# Altium schematic sheet Sheet1.SchDoc
size A4
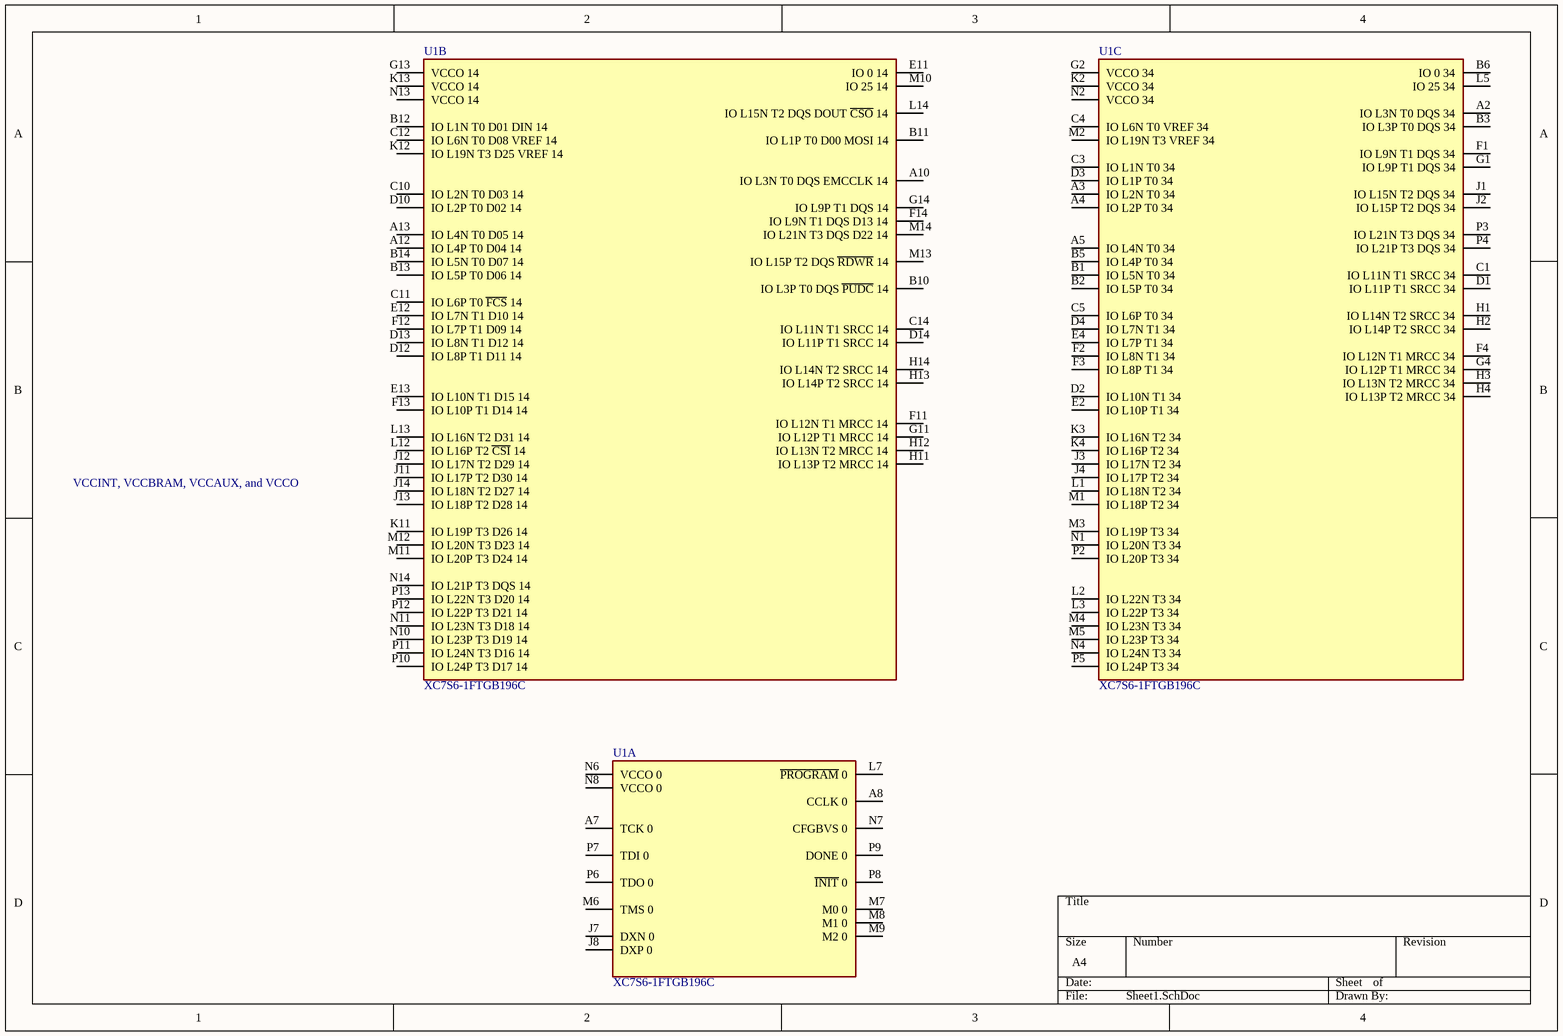
[diagram p0: Sheet1.SchDoc]

## Parts
U1  XC7S6-1FTGB196C  [FP-XC7S6-1FTGB196C-MFG]  (parts A,B,C of 4)

## Nets

Not connected (* = marked no-connect by the designer): U1 A2(IO_L3N_T0_DQS_34) A3(IO_L2N_T0_34) A4(IO_L2P_T0_34) A5(IO_L4N_T0_34) A7(TCK_0) A8(CCLK_0) A10(IO_L3N_T0_DQS_EMCCLK_14) A12(IO_L4P_T0_D04_14) A13(IO_L4N_T0_D05_14) B1(IO_L5N_T0_34) B2(IO_L5P_T0_34) B3(IO_L3P_T0_DQS_34) B5(IO_L4P_T0_34) B6(IO_0_34) B10(IO_L3P_T0_DQS_~{PUDC}_14) B11(IO_L1P_T0_D00_MOSI_14) B12(IO_L1N_T0_D01_DIN_14) B13(IO_L5P_T0_D06_14) B14(IO_L5N_T0_D07_14) C1(IO_L11N_T1_SRCC_34) C3(IO_L1N_T0_34) C4(IO_L6N_T0_VREF_34) C5(IO_L6P_T0_34) C10(IO_L2N_T0_D03_14) C11(IO_L6P_T0_~{FCS}_14) C12(IO_L6N_T0_D08_VREF_14) C14(IO_L11N_T1_SRCC_14) D1(IO_L11P_T1_SRCC_34) D2(IO_L10N_T1_34) D3(IO_L1P_T0_34) D4(IO_L7N_T1_34) D10(IO_L2P_T0_D02_14) D12(IO_L8P_T1_D11_14) D13(IO_L8N_T1_D12_14) D14(IO_L11P_T1_SRCC_14) E2(IO_L10P_T1_34) E4(IO_L7P_T1_34) E11(IO_0_14) E12(IO_L7N_T1_D10_14) E13(IO_L10N_T1_D15_14) F1(IO_L9N_T1_DQS_34) F2(IO_L8N_T1_34) F3(IO_L8P_T1_34) F4(IO_L12N_T1_MRCC_34) F11(IO_L12N_T1_MRCC_14) F12(IO_L7P_T1_D09_14) F13(IO_L10P_T1_D14_14) F14(IO_L9N_T1_DQS_D13_14) G1(IO_L9P_T1_DQS_34) G2(VCCO_34) G4(IO_L12P_T1_MRCC_34) G11(IO_L12P_T1_MRCC_14) G13(VCCO_14) G14(IO_L9P_T1_DQS_14) H1(IO_L14N_T2_SRCC_34) H2(IO_L14P_T2_SRCC_34) H3(IO_L13N_T2_MRCC_34) H4(IO_L13P_T2_MRCC_34) H11(IO_L13P_T2_MRCC_14) H12(IO_L13N_T2_MRCC_14) H13(IO_L14P_T2_SRCC_14) H14(IO_L14N_T2_SRCC_14) J1(IO_L15N_T2_DQS_34) J2(IO_L15P_T2_DQS_34) J3(IO_L17N_T2_34) J4(IO_L17P_T2_34) J7(DXN_0) J8(DXP_0) J11(IO_L17P_T2_D30_14) J12(IO_L17N_T2_D29_14) J13(IO_L18P_T2_D28_14) J14(IO_L18N_T2_D27_14) K2(VCCO_34) K3(IO_L16N_T2_34) K4(IO_L16P_T2_34) K11(IO_L19P_T3_D26_14) K12(IO_L19N_T3_D25_VREF_14) K13(VCCO_14) L1(IO_L18N_T2_34) L2(IO_L22N_T3_34) L3(IO_L22P_T3_34) L5(IO_25_34) L7(~{PROGRAM}_0) L12(IO_L16P_T2_~{CSI}_14) L13(IO_L16N_T2_D31_14) L14(IO_L15N_T2_DQS_DOUT_~{CSO}_14) M1(IO_L18P_T2_34) M2(IO_L19N_T3_VREF_34) M3(IO_L19P_T3_34) M4(IO_L23N_T3_34) M5(IO_L23P_T3_34) M6(TMS_0) M7(M0_0) M8(M1_0) M9(M2_0) M10(IO_25_14) M11(IO_L20P_T3_D24_14) M12(IO_L20N_T3_D23_14) M13(IO_L15P_T2_DQS_~{RDWR}_14) M14(IO_L21N_T3_DQS_D22_14) N1(IO_L20N_T3_34) N2(VCCO_34) N4(IO_L24N_T3_34) N6(VCCO_0) N7(CFGBVS_0) N8(VCCO_0) N10(IO_L23P_T3_D19_14) N11(IO_L23N_T3_D18_14) N13(VCCO_14) N14(IO_L21P_T3_DQS_14) P2(IO_L20P_T3_34) P3(IO_L21N_T3_DQS_34) P4(IO_L21P_T3_DQS_34) P5(IO_L24P_T3_34) P6(TDO_0) P7(TDI_0) P8(~{INIT}_0) P9(DONE_0) P10(IO_L24P_T3_D17_14) P11(IO_L24N_T3_D16_14) P12(IO_L22P_T3_D21_14) P13(IO_L22N_T3_D20_14)

## Notes on the sheet
- VCCINT, VCCBRAM, VCCAUX, and VCCO

## Library data of the parts
U1 = CMP-17530-000008-1: Manufacturer: Xilinx; Standoff Height: 0.3mm; Max Supply Voltage: 3.465V; Number Of Logic Elements Cells: 6000; Number Of I/Os: 100; Min Supply Voltage: 0.95V; Ram Size: 180Kbits; Frequency: 200MHz; Max Junction Temp: +85°C; Speed Grade: 1; Propagation Delay: 0.13ns; Number Of Logic Blocks: 938; Lead Free: Yes; Device Class L1: Integrated Circuits (ICs); Category: IC; Ipc Land Pattern Name: BGA196C100P14X14_1500X1500X146; Manufacturer Part Number: XC7S6-1FTGB196C; Temperature Range High: +85°C; ComponentLink2Description: Datasheet; Package: XC7S6-1FTGB196C; Height: 1.55mm; Device Class L2: Embedded Processors and Controllers; Digikey Description: XC7S6-1FTGB196C; Temperature: 0°C to +85°C; Device Class L3: FPGAs - Field Programmable Gate Arrays; Automotive: No; Octopart: https://octopart.com/xc7s6-1ftgb196c-xilinx-81890684; Footprint Url: https://www.xilinx.com/support/documentation/user_guides/ug475_7Series_Pkg_Pinout.pdf; ComponentLink2URL: https://www.xilinx.com/support/documentation/data_sheets/ds189-spartan-7-data-sheet.pdf; RoHS: TRUE; Temperature Range Low: 0°C